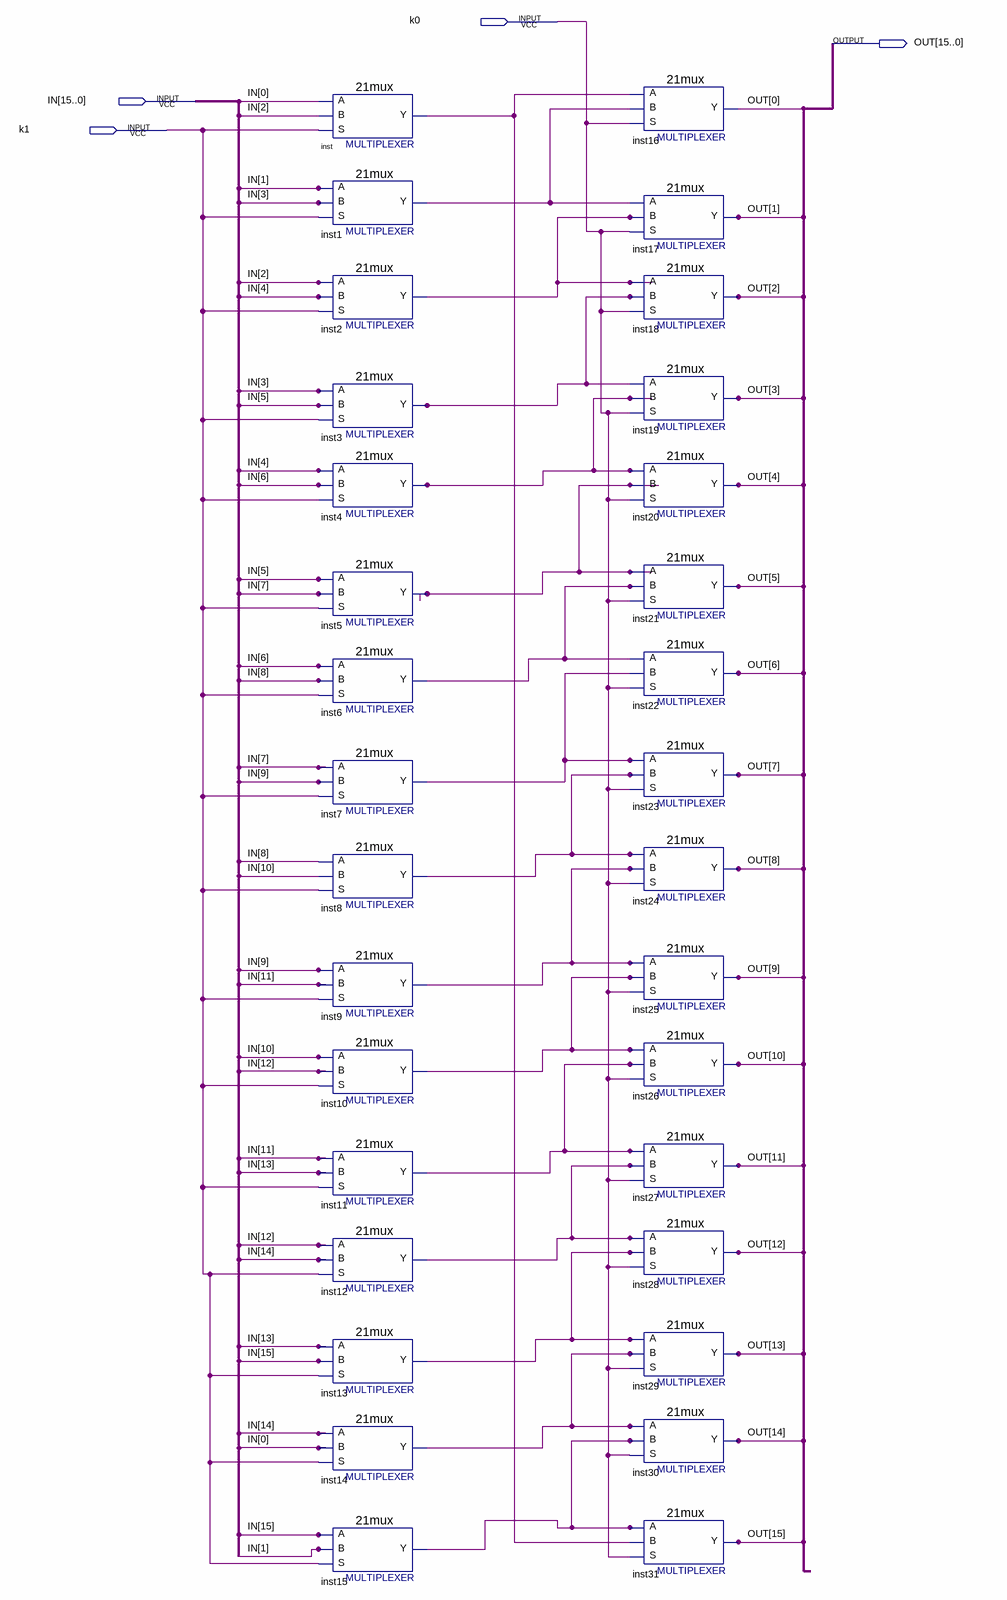
[diagram p0: schematic sheet]
// Quartus schematic BarrelShifter16.bdf as structural Verilog: 32 symbols, 4 pins
module BarrelShifter16 (
  input  k0,
  input  [15:0] IN,
  input  k1,
  output [15:0] OUT
);

  wire inst1_y, inst2_y, inst3_y, inst4_y, inst5_y, inst6_y, inst7_y, inst8_y, inst9_y, inst10_y, inst11_y,
       inst12_y, inst13_y, inst14_y, inst15_y, inst_y;

  \21mux  inst (.S(k1), .B(IN[2]), .A(IN[0]), .Y(inst_y));
  \21mux  inst1 (.S(k1), .B(IN[3]), .A(IN[1]), .Y(inst1_y));
  \21mux  inst2 (.S(k1), .B(IN[4]), .A(IN[2]), .Y(inst2_y));
  \21mux  inst3 (.S(k1), .B(IN[5]), .A(IN[3]), .Y(inst3_y));
  \21mux  inst4 (.S(k1), .B(IN[6]), .A(IN[4]), .Y(inst4_y));
  \21mux  inst5 (.S(k1), .B(IN[7]), .A(IN[5]), .Y(inst5_y));
  \21mux  inst6 (.S(k1), .B(IN[8]), .A(IN[6]), .Y(inst6_y));
  \21mux  inst7 (.S(k1), .B(IN[9]), .A(IN[7]), .Y(inst7_y));
  \21mux  inst8 (.S(k1), .B(IN[10]), .A(IN[8]), .Y(inst8_y));
  \21mux  inst9 (.S(k1), .B(IN[11]), .A(IN[9]), .Y(inst9_y));
  \21mux  inst10 (.S(k1), .B(IN[12]), .A(IN[10]), .Y(inst10_y));
  \21mux  inst11 (.S(k1), .B(IN[13]), .A(IN[11]), .Y(inst11_y));
  \21mux  inst12 (.S(k1), .B(IN[14]), .A(IN[12]), .Y(inst12_y));
  \21mux  inst13 (.S(k1), .B(IN[15]), .A(IN[13]), .Y(inst13_y));
  \21mux  inst14 (.S(k1), .B(IN[0]), .A(IN[14]), .Y(inst14_y));
  \21mux  inst15 (.S(k1), .B(IN[1]), .A(IN[15]), .Y(inst15_y));
  \21mux  inst16 (.S(k0), .B(inst1_y), .A(inst_y), .Y(OUT[0]));
  \21mux  inst17 (.S(k0), .B(inst2_y), .A(inst1_y), .Y(OUT[1]));
  \21mux  inst18 (.S(k0), .B(inst3_y), .A(inst2_y), .Y(OUT[2]));
  \21mux  inst19 (.S(k0), .B(inst4_y), .A(inst3_y), .Y(OUT[3]));
  \21mux  inst20 (.S(k0), .B(inst5_y), .A(inst4_y), .Y(OUT[4]));
  \21mux  inst21 (.S(k0), .B(inst6_y), .A(inst5_y), .Y(OUT[5]));
  \21mux  inst22 (.S(k0), .B(inst7_y), .A(inst6_y), .Y(OUT[6]));
  \21mux  inst23 (.S(k0), .B(inst8_y), .A(inst7_y), .Y(OUT[7]));
  \21mux  inst24 (.S(k0), .B(inst9_y), .A(inst8_y), .Y(OUT[8]));
  \21mux  inst25 (.S(k0), .B(inst10_y), .A(inst9_y), .Y(OUT[9]));
  \21mux  inst26 (.S(k0), .B(inst11_y), .A(inst10_y), .Y(OUT[10]));
  \21mux  inst27 (.S(k0), .B(inst12_y), .A(inst11_y), .Y(OUT[11]));
  \21mux  inst28 (.S(k0), .B(inst13_y), .A(inst12_y), .Y(OUT[12]));
  \21mux  inst29 (.S(k0), .B(inst14_y), .A(inst13_y), .Y(OUT[13]));
  \21mux  inst30 (.S(k0), .B(inst15_y), .A(inst14_y), .Y(OUT[14]));
  \21mux  inst31 (.S(k0), .B(inst_y), .A(inst15_y), .Y(OUT[15]));
endmodule
